# EasyEDA schematic AT32F437.json
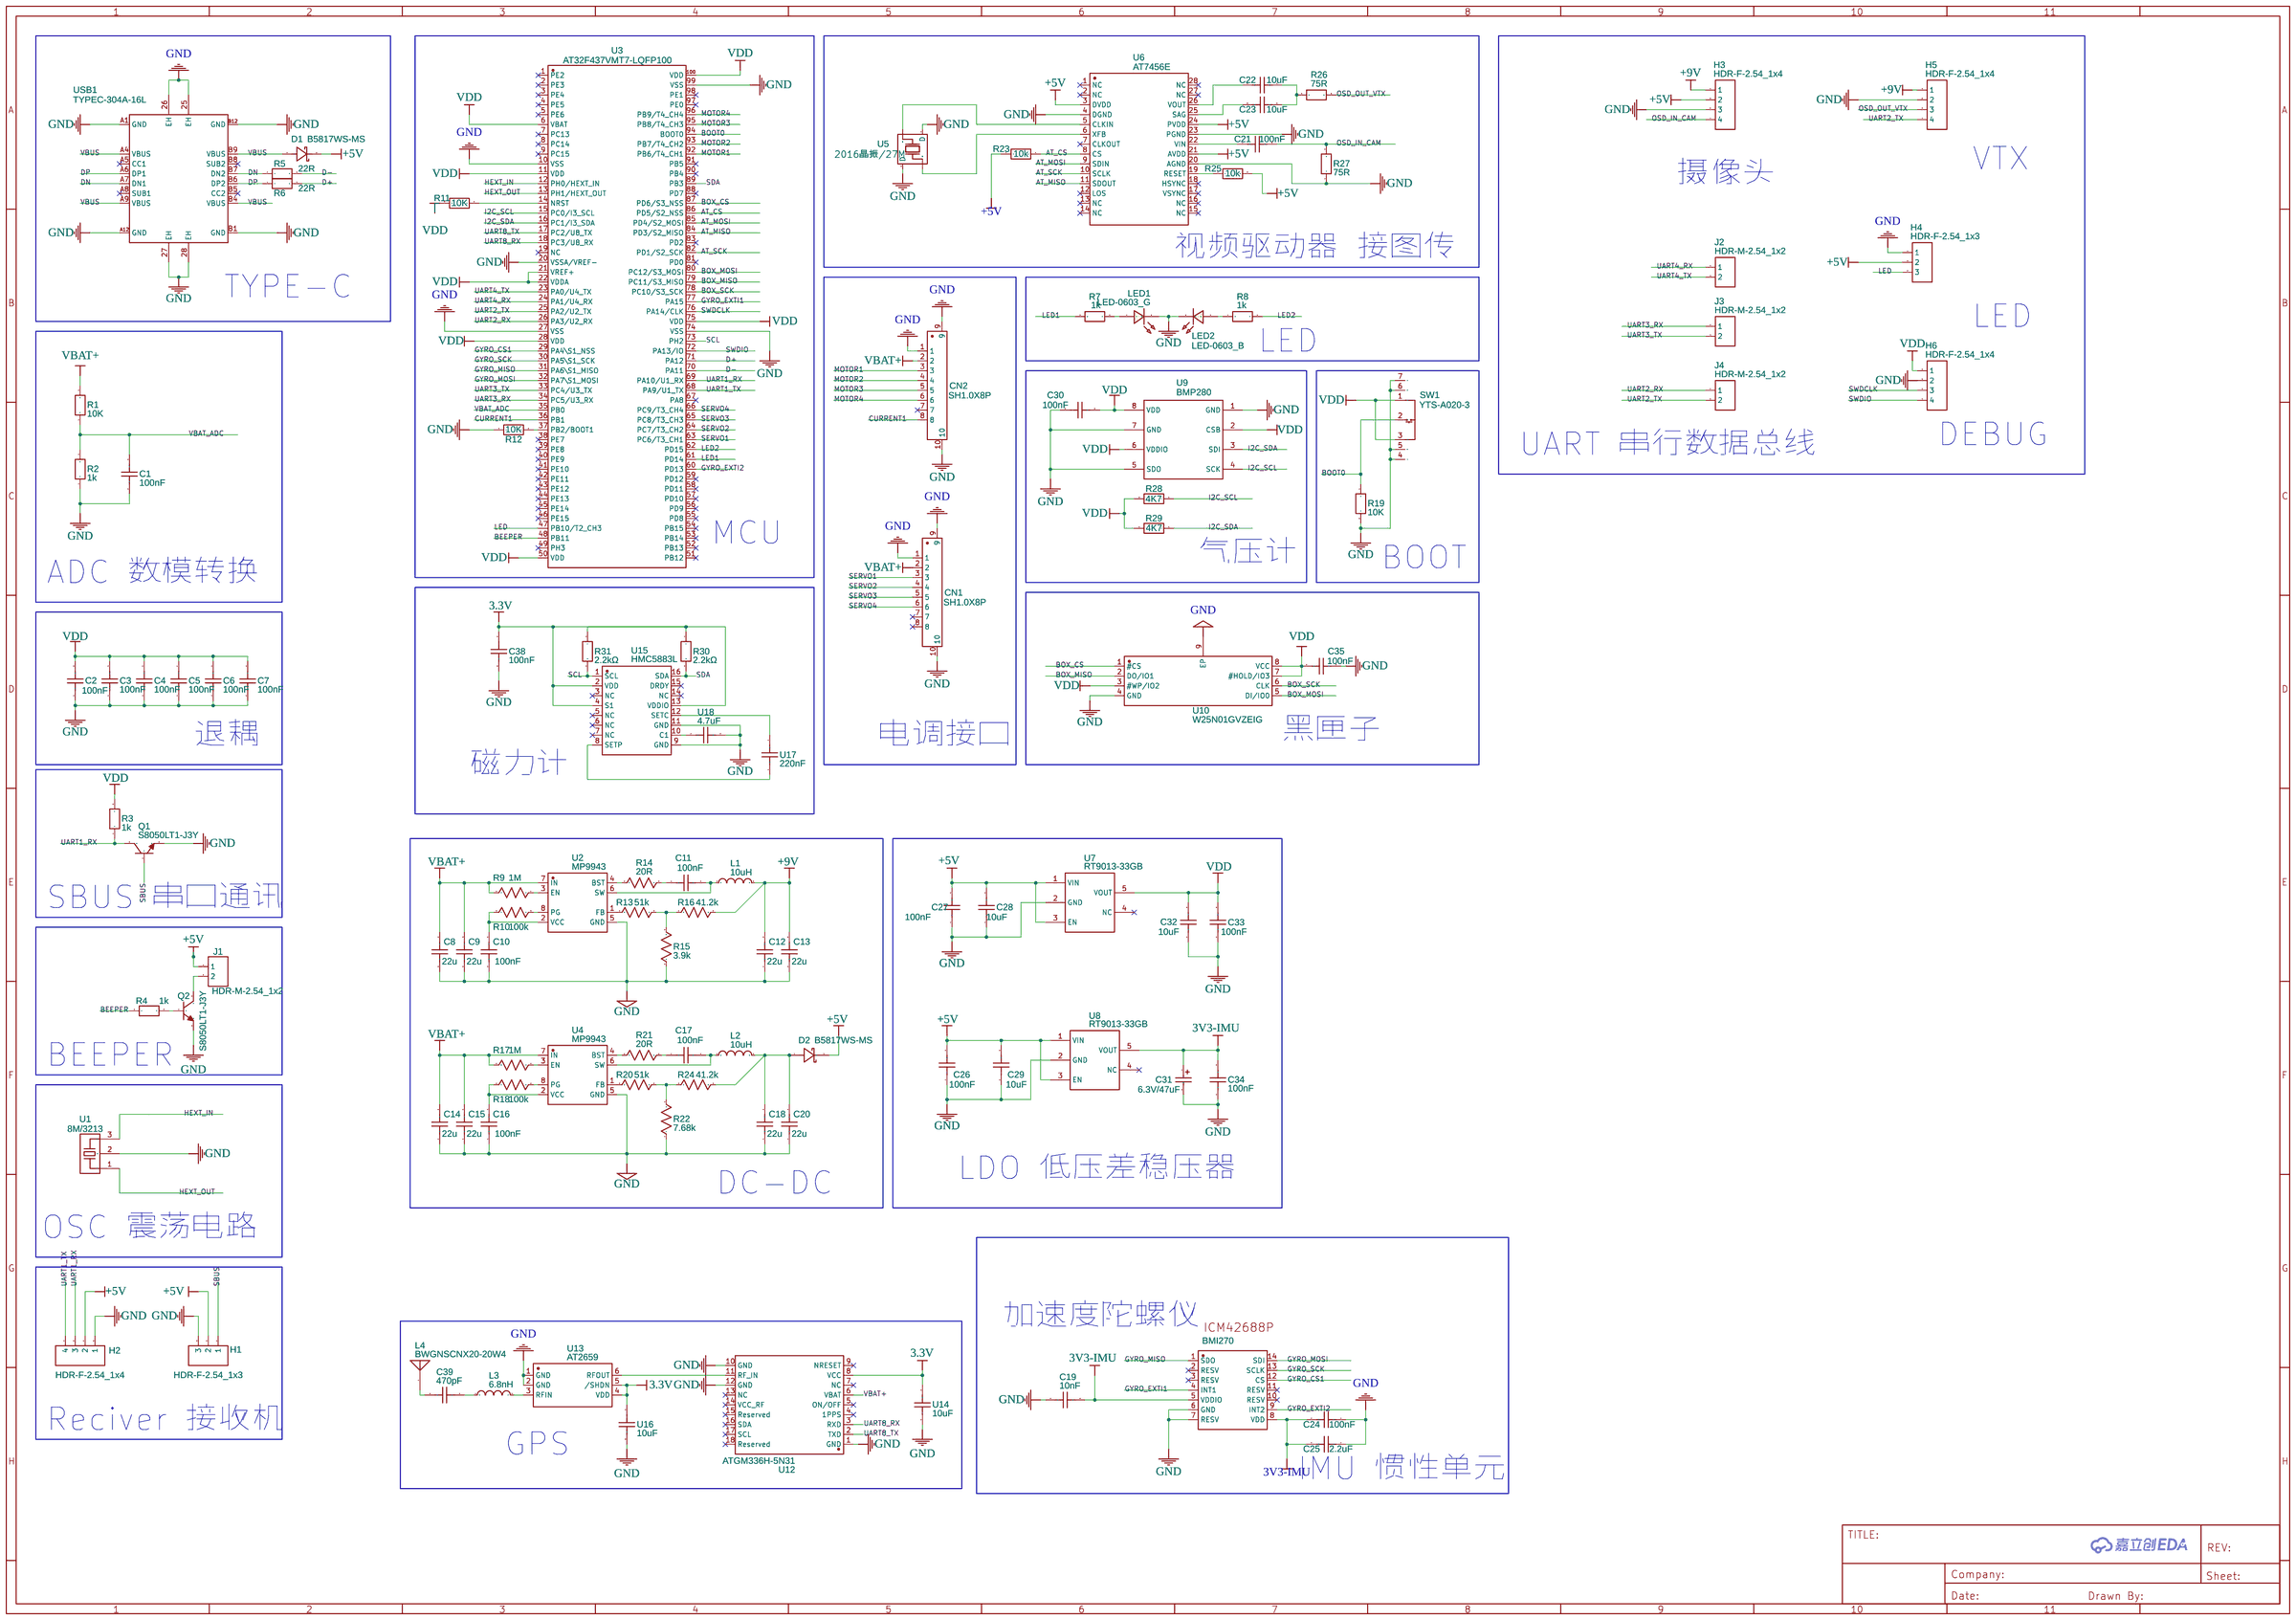
[diagram p0: schematic sheet]

## Parts
C1  100nF  [0603-RES]
C2  100nF  [0603-RES]
C3  100nF  [0603-RES]
C4  100nF  [0603-RES]
C5  100nF  [0603-RES]
C6  100nF  [0603-RES]
C7  100nF  [0603-RES]
C8  22u  [C_0805_KICAD]
C9  22u  [C_0805_KICAD]
C10  100nF  [0603-RES]
C11  100nF  [0603-RES]
C12  22u  [C_0805_KICAD]
C13  22u  [C_0805_KICAD]
C14  22u  [C_0805_KICAD]
C15  22u  [C_0805_KICAD]
C16  100nF  [0603-RES]
C17  100nF  [0603-RES]
C18  22u  [C_0805_KICAD]
C19  10nF  [0603-RES]
C20  22u  [C_0805_KICAD]
C21  100nF  [0603-RES]
C22  10uF  [0603-RES]
C23  10uF  [0603-RES]
C24  100nF  [0603-RES]
C25  2.2uF  [0603-RES]
C26  100nF  [0603-RES]
C27  100nF  [0603-RES]
C28  10uF  [0603-RES]
C29  10uF  [0603-RES]
C30  100nF  [0603-RES]
C31  6.3V/47uF  [钽电容B型_3528]
C32  10uF  [0603-RES]
C33  100nF  [0603-RES]
C34  100nF  [0603-RES]
C35  100nF  [0603-RES]
C38  100nF  [C0603]
C39  470pF  [C0603]
CN1  SH1.0X8P  [CONN-SMD_8P-P1.00_WAFER-SH1.0-8PWB]
CN2  SH1.0X8P  [CONN-SMD_8P-P1.00_WAFER-SH1.0-8PWB]
D1  B5817WS-MS  [SOD-323_L1.7-W1.3-LS2.7-FD]
D2  B5817WS-MS  [SOD-323_L1.7-W1.3-LS2.7-FD]
H1  HDR-F-2.54_1x3  [HDR-F-2.54_1X3]
H2  HDR-F-2.54_1x4  [HDR-F-2.54_1X4]
H3  HDR-F-2.54_1x4  [HDR-F-2.54_1X4]
H4  HDR-F-2.54_1x3  [HDR-F-2.54_1X3]
H5  HDR-F-2.54_1x4  [HDR-F-2.54_1X4]
H6  HDR-F-2.54_1x4  [HDR-F-2.54_1X4]
J1  HDR-M-2.54_1x2  [HDR-M-2.54_1X2]
J2  HDR-M-2.54_1x2  [HDR-M-2.54_1X2]
J3  HDR-M-2.54_1x2  [HDR-M-2.54_1X2]
J4  HDR-M-2.54_1x2  [HDR-M-2.54_1X2]
L1  10uH  [IND-SMD_L4.4-W4.0_PHC0420]
L2  10uH  [IND-SMD_L4.4-W4.0_PHC0420]
L3  6.8nH  [L0201]
L4  BWGNSCNX20-20W4  [ANT-TH_BWGNSCNX20-20W4]
LED1  LED-0603_G  [0603-RES]
LED2  LED-0603_B  [0603-RES]
Q1  S8050LT1-J3Y  [SOT-23_L2.9-W1.3-P1.90-LS2.4-BR]
Q2  S8050LT1-J3Y  [SOT-23_L2.9-W1.3-P1.90-LS2.4-BR]
R1  10K  [0603-RES]
R2  1k  [0603-RES]
R3  1k  [0603-RES]
R4  1k  [0603-RES]
R5  22R  [0603-RES]
R6  22R  [0603-RES]
R7  1k  [0603-RES]
R8  1k  [0603-RES]
R9  1M  [0603-RES]
R10  100k  [0603-RES]
R11  10K  [0603-RES]
R12  10K  [0603-RES]
R13  51k  [0603-RES]
R14  20R  [0603-RES]
R15  3.9k  [0603-RES]
R16  41.2k  [0603-RES]
R17  1M  [0603-RES]
R18  100k  [0603-RES]
R19  10K  [0603-RES]
R20  51k  [0603-RES]
R21  20R  [0603-RES]
R22  7.68k  [0603-RES]
R23  10k  [0603-RES]
R24  41.2k  [0603-RES]
R25  10k  [0603-RES]
R26  75R  [0603-RES]
R27  75R  [0603-RES]
R28  4K7  [0603-RES]
R29  4K7  [0603-RES]
R30  2.2kΩ  [R0603]
R31  2.2kΩ  [R0603]
SDO1  BMI270  [LGA-14_L3.0-W2.5-P0.50-TL]
SW1  YTS-A020-3  [SW-SMD_YIYUAN_YTS-A020-3]
U1  8M/3213  [X3213]
U2  MP9943  [QFN-8-3X3]
U3  AT32F437VMT7-LQFP100  [LQFP-100_L14.0-W14.0-P0.50-LS16.0-TL]
U4  MP9943  [QFN-8-3X3]
U5  2016晶振/27M  [2016晶振]
U6  AT7456E  [TSSOP-28_L9.7-W4.4-P0.65-LS6.4-BL-EP5.5]
U7  RT9013-33GB  [SOT-23-5_L3.0-W1.7-P0.95-LS2.8-BR]
U8  RT9013-33GB  [SOT-23-5_L3.0-W1.7-P0.95-LS2.8-BR]
U9  BMP280  [SENSOR-TH_BMP280-BL]
U10  W25N01GVZEIG  [WSON-8_L8.0-W6.10-P1.27-EP]
U12  ATGM336H-5N31  [GPSM-SMD_ATGM336H-TR]
U13  AT2659  [DFN-6_L1.6-W1.0-P0.55-BL]
U14  10uF  [C0603]
U15  HMC5883L  [LPCC-16_L3.0-W3.0-P0.50-BL]
U16  10uF  [C0603]
U17  220nF  [C0603]
U18  4.7uF  [C0402]
USB1  TYPEC-304A-16L  [USB-C-SMD_XUNPU_TYPEC-304A-ACP16L]

## Library data of the parts
C1-C7 C19 C21 C24 C25 C29 C30 C34 C35 = C_0402_US: Contributor: LCEDA_Lib
C8-C18 C20 = C_0201_US: Contributor: LCEDA_Lib
C22 C23 C26-C28 C32 C33 = C_0603_US: Contributor: LCEDA_Lib
C31 = TAJA476K006RNJ: Supplier: LCSC; Manufacturer: AVX; Supplier Part: C7190; JLCPCB Part Class: Extended Part
C38 = CC0603MRY5V8BB104: Supplier: LCSC; Supplier Part: C519502; Manufacturer: YAGEO(国巨); JLCPCB Part Class: Extended Part; Contributor: lcsc
C39 = FM18X471K101PSG: Contributor: LCSC; Supplier: LCSC; Supplier Part: C382252; Manufacturer: PSA(信昌电陶); JLCPCB Part Class: Extended Part
CN1 CN2 = WAFER_SMT_1.0X8: Supplier: LCSC; Supplier Part: C9900021939; Manufacturer: null; JLCPCB Part Class: Extended Part; Contributor: lcsc
D1 D2 = B5817WS-MS: Supplier: LCSC; Supplier Part: C2836388; Manufacturer: MSKSEMI(美森科); JLCPCB Part Class: Extended Part; Contributor: LCSC
H1 H4 = HDR-F-2.54_1x3: Supplier Part: C146690; Supplier: LCSC; Contributor: LCEDA_Lib
H2 H3 H5 H6 = HDR-F-2.54_1x4: Supplier Part: C225501; Supplier: LCSC; Contributor: LCEDA_Lib
J1-J4 = HDR-M-2.54_1x2: Supplier Part: C124375; Supplier: LCSC; Contributor: LCEDA_Lib
L1 L2 = PHC0420-100M-T: Supplier: LCSC; Supplier Part: C251694; Manufacturer: EMTEK; Contributor: LCSC
L3 = VHF060303H6N8KT: Contributor: LCSC; Supplier: LCSC; Supplier Part: C381687; Manufacturer: FH(风华); JLCPCB Part Class: Extended Part
L4 = BWGNSCNX20-20W4: Contributor: LCSC; Supplier: LCSC; Supplier Part: C784396; Manufacturer: BAT WIRELESS(蝙蝠无线); JLCPCB Part Class: Extended Part
LED1 = LED-0603_G: Manufacturer: EVERLIGHT(台湾亿光); Manufacturer Part: 19-217/GHC-YR1S2/3T; Supplier Part: C72043; Supplier: LCSC; Contributor: LCEDA_Lib
LED2 = LED-0603_B: Manufacturer: EVERLIGHT(台湾亿光); Manufacturer Part: 19-217/BHC-ZL1M2RY/3T; Supplier Part: C72041; Supplier: LCSC; Contributor: LCEDA_01
Q1 Q2 = S8050LT1-J3Y: Supplier: LCSC; Supplier Part: C2962087; Manufacturer: FH(风华); link: https://atta.szlcsc.com/upload/public/pdf/source/20220411/740B3F4857AB400E9826209E74F1EDA4.pdf; Contributor: lcsc
R1 R2 R7 R8 R11 R12 R19 = R_0603_EU: Contributor: LCEDA_Lib
R3-R6 R23 R25 R28 R29 = R_0402_EU: Contributor: LCEDA_Lib
R9 R10 R13-R18 R20-R22 R24 = R_0201_US: Contributor: LCEDA_Lib
R26 R27 = R_0805_EU: Contributor: LCEDA_Lib
R30 R31 = SCR0603J2K2: Contributor: lcsc; Supplier: LCSC; Supplier Part: C3017730; Manufacturer: VO(翔胜); JLCPCB Part Class: Extended Part
SDO1 = ICM42688-P: link: https://3cfeqx1hf82y3xcoull08ihx-wpengine.netdna-ssl.com/wp-content/uploads/2020/09/DS-000347-ICM-42688-P-v1.3.pdf; Contributor: SPRain; Package Display: No
SW1 = YTS-A020-3: Supplier: LCSC; Supplier Part: C2910682; Manufacturer: YIYUAN(怡远); Contributor: LCSC
U1 = 3213晶振: Contributor: 5_6956
U2 U4 = MP9943: Contributor: jeasyn
U3 = AT32F435VGT7: Supplier: LCSC; Supplier Part: C3029578; Manufacturer: ARTERY（雅特力）; Manufacturer Part: AT32F435VMT7; link: https://atta.szlcsc.com/upload/public/pdf/source/20220608/9A6D4578C11CEA8ECA586071DFEBC06A.pdf; Contributor: lcsc; Package Display: No
U5 = 3225晶振: Contributor: jimssa
U6 = AT7456E: Supplier: LCSC; Manufacturer: ZHONGKEWEI; Supplier Part: C82351; JLCPCB Part Class: Extended Part
U7 U8 = RT9013-33GB: Supplier: LCSC; Manufacturer: RICHTEK; Supplier Part: C47773; JLCPCB Part Class: Extended Part
U9 = BMP280: Supplier: LCSC; Manufacturer: Bosch; Supplier Part: C83291; JLCPCB Part Class: Extended Part
U10 = W25N01GVZEIG NoHole: Supplier: LCSC; Supplier Part: C88868; Manufacturer: Winbond Elec; Contributor: SudoMaker; JLCPCB Part Class: Extended Part
U12 = ATGM336H-5N31: Supplier: LCSC; Manufacturer: 杭州中科微; Supplier Part: C90770; JLCPCB Part Class: Extended Part
U13 = AT2659: Contributor: 立创EDA官方封装库; Supplier: LCSC; Manufacturer: 杭州中科微; Supplier Part: C92450; JLCPCB Part Class: Extended Part
U14 U16 = 0603X106K100CT: Contributor: LCSC; Supplier: LCSC; Supplier Part: C2840513; Manufacturer: Walsin(华新科); JLCPCB Part Class: Extended Part
U15 = HMC5883L: Contributor: LCSC; Supplier: LCSC; Supplier Part: C2859540; Manufacturer: null; JLCPCB Part Class: Extended Part
U17 = CGA3E3X5R1V224M080AB: Contributor: lcsc; Supplier: LCSC; Supplier Part: C3845923; Manufacturer: TDK
U18 = C1005X5R1A475M050BC: Contributor: lcsc; Supplier: LCSC; Supplier Part: C3852325; Manufacturer: TDK; JLCPCB Part Class: Extended Part
USB1 = TYPEC-304A-ACP16L: Supplier: LCSC; Supplier Part: C2909609; Manufacturer: XUNPU(讯普); Contributor: LCSC; JLCPCB Part Class: Extended Part

## Nets
3.3V: C38.1 R30.1 R31.1 U12.8(VCC) U13.4(VDD) U13.5(/SHDN) U14.1 U15.2(VDD) U15.4(S1) U15.13(VDDIO) U16.1
3V3-IMU: C19.2 C24.2 C25.2 C31.1 C34.2 SDO1.5(VDDIO) SDO1.8(VDD) U8.5(VOUT)
+5V: C26.2 C27.2 C28.2 C29.2 D1.2(K) D2.2(K) H1.2 H2.2 H3.2 H4.2 J1.1 R23.1 R25.2 U6.3(DVDD) U6.21(AVDD) U6.24(PVDD) U7.1(VIN) U7.3(EN) U8.1(VIN) U8.3(EN)
+9V: C12.2 C13.2 H3.1 H5.1 L1.2 R16.2
GND: C1.1 C2.1 C3.1 C4.1 C5.1 C6.1 C7.1 C8.1 C9.1 C10.1 C12.1 C13.1 C14.1 C15.1 C16.1 C18.1 C19.1 C20.1 C24.1 C25.1 C26.1 C27.1 C28.1 C29.1 C30.1 C31.2 C32.1 C33.1 C34.1 C35.2 C38.2 CN1.1 CN1.9 CN1.10 CN2.1 CN2.9 CN2.10 H1.3 H2.1 H3.3 H4.1 H5.2 H6.2 LED1.2 LED2.2 Q1.2 Q2.2 R2.1 R12.1 R15.1 R19.2 R22.1 R27.1 SDO1.6(GND) SDO1.7(RESV) SW1.4 SW1.5 SW1.6 SW1.7 U1.2 U2.5(GND) U3.10(VSS) U3.20(VSSA/VREF-) U3.27(VSS) U3.74(VSS) U3.99(VSS) U4.5(GND) U5.2(D) U5.4(D) U6.4(DGND) U6.20(AGND) U6.23(PGND) U7.2(GND) U8.2(GND) U9.1(GND) U9.5(SDO) U9.7(GND) U10.4(GND) U10.9(EP) U12.1(GND) U12.10(GND) U12.12(GND) U13.1(GND) U13.2(GND) U14.2 U15.9(GND) U15.11(GND) U16.2 U18.2 USB1.25(EH) USB1.26(EH) USB1.27(EH) USB1.28(EH) USB1.A1(GND) USB1.A12(GND) USB1.B1(GND) USB1.B12(GND)
VBAT+: C8.2 C9.2 C14.2 C15.2 CN1.2 CN2.2 R1.2 R9.2 R17.2 U2.7(IN) U4.7(IN) U12.6(VBAT)
VBAT_ADC: C1.2 R1.1 R2.2 U3.35(PB0)
VBUS: D1.1(A) USB1.A4(VBUS) USB1.A9(VBUS) USB1.B4(VBUS) USB1.B9(VBUS)
VDD: C2.2 C3.2 C4.2 C5.2 C6.2 C7.2 C30.2 C32.2 C33.2 C35.1 H6.1 R3.2 R11.2 R28.2 R29.2 SW1.1 SW1.3 U3.6(VBAT) U3.11(VDD) U3.21(VREF+) U3.22(VDDA) U3.28(VDD) U3.50(VDD) U3.75(VDD) U3.100(VDD) U7.5(VOUT) U9.2(CSB) U9.6(VDDIO) U9.8(VDD) U10.3(#WP/IO2) U10.7(#HOLD/IO3) U10.8(VCC)
AT_CS: R23.2 U3.86(PD5/S2_NSS) U6.8(CS)
AT_MISO: U3.84(PD3/S2_MISO) U6.11(SDOUT)
AT_MOSI: U3.85(PD4/S2_MOSI) U6.9(SDIN)
AT_SCK: U3.82(PD1/S2_SCK) U6.10(SCLK)
BEEPER: R4.1 U3.48(PB11)
BOOT0: R19.1 SW1.2 U3.94(BOOT0)
BOX_CS: U3.87(PD6/S3_NSS) U10.1(#CS)
BOX_MISO: U3.79(PC11/S3_MISO) U10.2(DO/IO1)
BOX_MOSI: U3.80(PC12/S3_MOSI) U10.5(DI/IO0)
BOX_SCK: U3.78(PC10/S3_SCK) U10.6(CLK)
CURRENT1: CN2.8 U3.36(PB1)
D+: R6.2 U3.71(PA12)
D-: R5.2 U3.70(PA11)
DN: R5.1 USB1.A7(DN1) USB1.B7(DN2)
DP: R6.1 USB1.A6(DP1) USB1.B6(DP2)
GYRO_CS1: SDO1.12(CS) U3.29(PA4\S1_NSS)
GYRO_EXTI1: SDO1.4(INT1) U3.77(PA15)
GYRO_EXTI2: SDO1.9(INT2) U3.60(PD13)
GYRO_MISO: SDO1.1(SDO) U3.31(PA6\S1_MISO)
GYRO_MOSI: SDO1.14(SDI) U3.32(PA7\S1_MOSI)
GYRO_SCK: SDO1.13(SCLK) U3.30(PA5\S1_SCK)
HEXT_IN: U1.3 U3.12(PH0/HEXT_IN)
HEXT_OUT: U1.1 U3.13(PH1/HEXT_OUT)
I2C_SCL: R28.1 U3.15(PC0/I3_SCL) U9.4(SCK)
I2C_SDA: R29.1 U3.16(PC1/I3_SDA) U9.3(SDI)
LED: H4.3 U3.47(PB10/T2_CH3)
LED1: R7.2 U3.61(PD14)
LED2: R8.2 U3.62(PD15)
MOTOR1: CN2.3 U3.92(PB6/T4_CH1)
MOTOR2: CN2.4 U3.93(PB7/T4_CH2)
MOTOR3: CN2.5 U3.95(PB8/T4_CH3)
MOTOR4: CN2.6 U3.96(PB9/T4_CH4)
OSD_IN_CAM: C21.2 H3.4 R27.2
OSD_OUT_VTX: H5.3 R26.2
SBUS: H1.1 Q1.1
SCL: R31.2 U3.73(PH2) U15.1(SCL)
SDA: R30.2 U3.89(PB3) U15.16(SDA)
SERVO1: CN1.3 U3.63(PC6/T3_CH1)
SERVO2: CN1.4 U3.64(PC7/T3_CH2)
SERVO3: CN1.5 U3.65(PC8/T3_CH3)
SERVO4: CN1.6 U3.66(PC9/T3_CH4)
SWDCLK: H6.3 U3.76(PA14/CLK)
SWDIO: H6.4 U3.72(PA13/IO)
UART1_RX: H2.3 Q1.3 R3.1 U3.69(PA10/U1_RX)
UART1_TX: H2.4 U3.68(PA9/U1_TX)
UART2_RX: J4.1 U3.26(PA3/U2_RX)
UART2_TX: H5.4 J4.2 U3.25(PA2/U2_TX)
UART3_RX: J3.1 U3.34(PC5/U3_RX)
UART3_TX: J3.2 U3.33(PC4/U3_TX)
UART4_RX: J2.1 U3.24(PA1/U4_RX)
UART4_TX: J2.2 U3.23(PA0/U4_TX)
UART8_RX: U3.18(PC3/U8_RX) U12.3(RXD)
UART8_TX: U3.17(PC2/U8_TX) U12.2(TXD)
Net-(C10-2): C10.2 R10.1 U2.2(VCC)
Net-(C11-1): C11.1 R14.2
Net-(C11-2): C11.2 L1.1 U2.6(SW)
Net-(C16-2): C16.2 R18.1 U4.2(VCC)
Net-(C17-1): C17.1 R21.2
Net-(C17-2): C17.2 L2.1 U4.6(SW)
Net-(C18-2): C18.2 C20.2 D2.1(A) L2.2 R24.2
Net-(C21-1): C21.1 U6.22(VIN)
Net-(C22-1): C22.1 C23.1 R26.1
Net-(C22-2): C22.2 U6.26(VOUT)
Net-(C23-2): C23.2 U6.25(SAG)
Net-(C39-1): C39.1 L3.1
Net-(C39-2): C39.2 L4.1
Net-(J1-2): J1.2 Q2.3
Net-(L3-2): L3.2 U13.3(RFIN)
Net-(LED1-1): LED1.1 R7.1
Net-(LED2-1): LED2.1 R8.1
Net-(Q2-1): Q2.1 R4.2
Net-(R9-1): R9.1 U2.3(EN)
Net-(R10-2): R10.2 U2.8(PG)
Net-(R11-1): R11.1 U3.14(NRST)
Net-(R12-2): R12.2 U3.37(PB2/BOOT1)
Net-(R13-1): R13.1 U2.1(FB)
Net-(R13-2): R13.2 R15.2 R16.1
Net-(R14-1): R14.1 U2.4(BST)
Net-(R17-1): R17.1 U4.3(EN)
Net-(R18-2): R18.2 U4.8(PG)
Net-(R20-1): R20.1 U4.1(FB)
Net-(R20-2): R20.2 R22.2 R24.1
Net-(R21-1): R21.1 U4.4(BST)
Net-(R25-1): R25.1 U6.19(RESET)
Net-(U5-1): U5.1(OSC1) U6.5(CLKIN)
Net-(U5-3): U5.3(OSC2) U6.6(XFB)
Net-(U12-11): U12.11(RF_IN) U13.6(RFOUT)
Net-(U15-8): U15.8(SETP) U17.2
Net-(U15-10): U15.10(C1) U18.1
Net-(U15-12): U15.12(SETC) U17.1

Not connected (* = marked no-connect by the designer): CN1 7* 8*; CN2 7*; SDO1 2(RESV)* 3(RESV)* 10(RESV)* 11(RESV)*; U3 1(PE2)* 2(PE3)* 3(PE4)* 4(PE5)* 5(PE6)* 7(PC13)* 8(PC14)* 9(PC15)* 19(NC)* 38(PE7)* 39(PE8)* 40(PE9)* 41(PE10)* 42(PE11)* 43(PE12)* 44(PE13)* 45(PE14)* 46(PE15)* 49(PH3)* 51(PB12)* 52(PB13)* 53(PB14)* 54(PB15)* 55(PD8)* 56(PD9)* 57(PD10)* 58(PD11)* 59(PD12)* 67(PA8)* 81(PD0)* 83(PD2)* 88(PD7)* 90(PB4)* 91(PB5)* 97(PE0)* 98(PE1)*; U6 1(NC)* 2(NC)* 7(CLKOUT)* 12(LOS)* 13(NC)* 14(NC)* 15(NC)* 16(NC)* 17(VSYNC)* 18(HSYNC)* 27(NC)* 28(NC)*; U7 4(NC)*; U8 4(NC)*; U12 4(1PPS)* 5(ON/OFF)* 7(NC)* 9(NRESET)* 13(NC)* 14(VCC_RF)* 15(Reserved)* 16(SDA)* 17(SCL)* 18(Reserved)*; U15 3(NC)* 5(NC)* 6(NC)* 7(NC)* 14(NC)* 15(DRDY)*; USB1 A5(CC1)* A8(SUB1)* B5(CC2)* B8(SUB2)*

## Notes on the sheet
- VTX
- 摄像头
- 视频驱动器 接图传
- TYPE-C
- LED
- LED
- DEBUG
- UART 串行数据总线
- MCU
- 气压计
- BOOT
- ADC 数模转换
- 黑匣子
- 退耦
- 电调接口
- 磁力计
- SBUS 串口通讯
- BEEPER
- LDO 低压差稳压器
- DC-DC
- OSC 震荡电路
- 加速度陀螺仪
- Reciver 接收机
- GPS
- IMU 惯性单元
